# EAGLE design simpleservo2 (EAGLE 4.16)
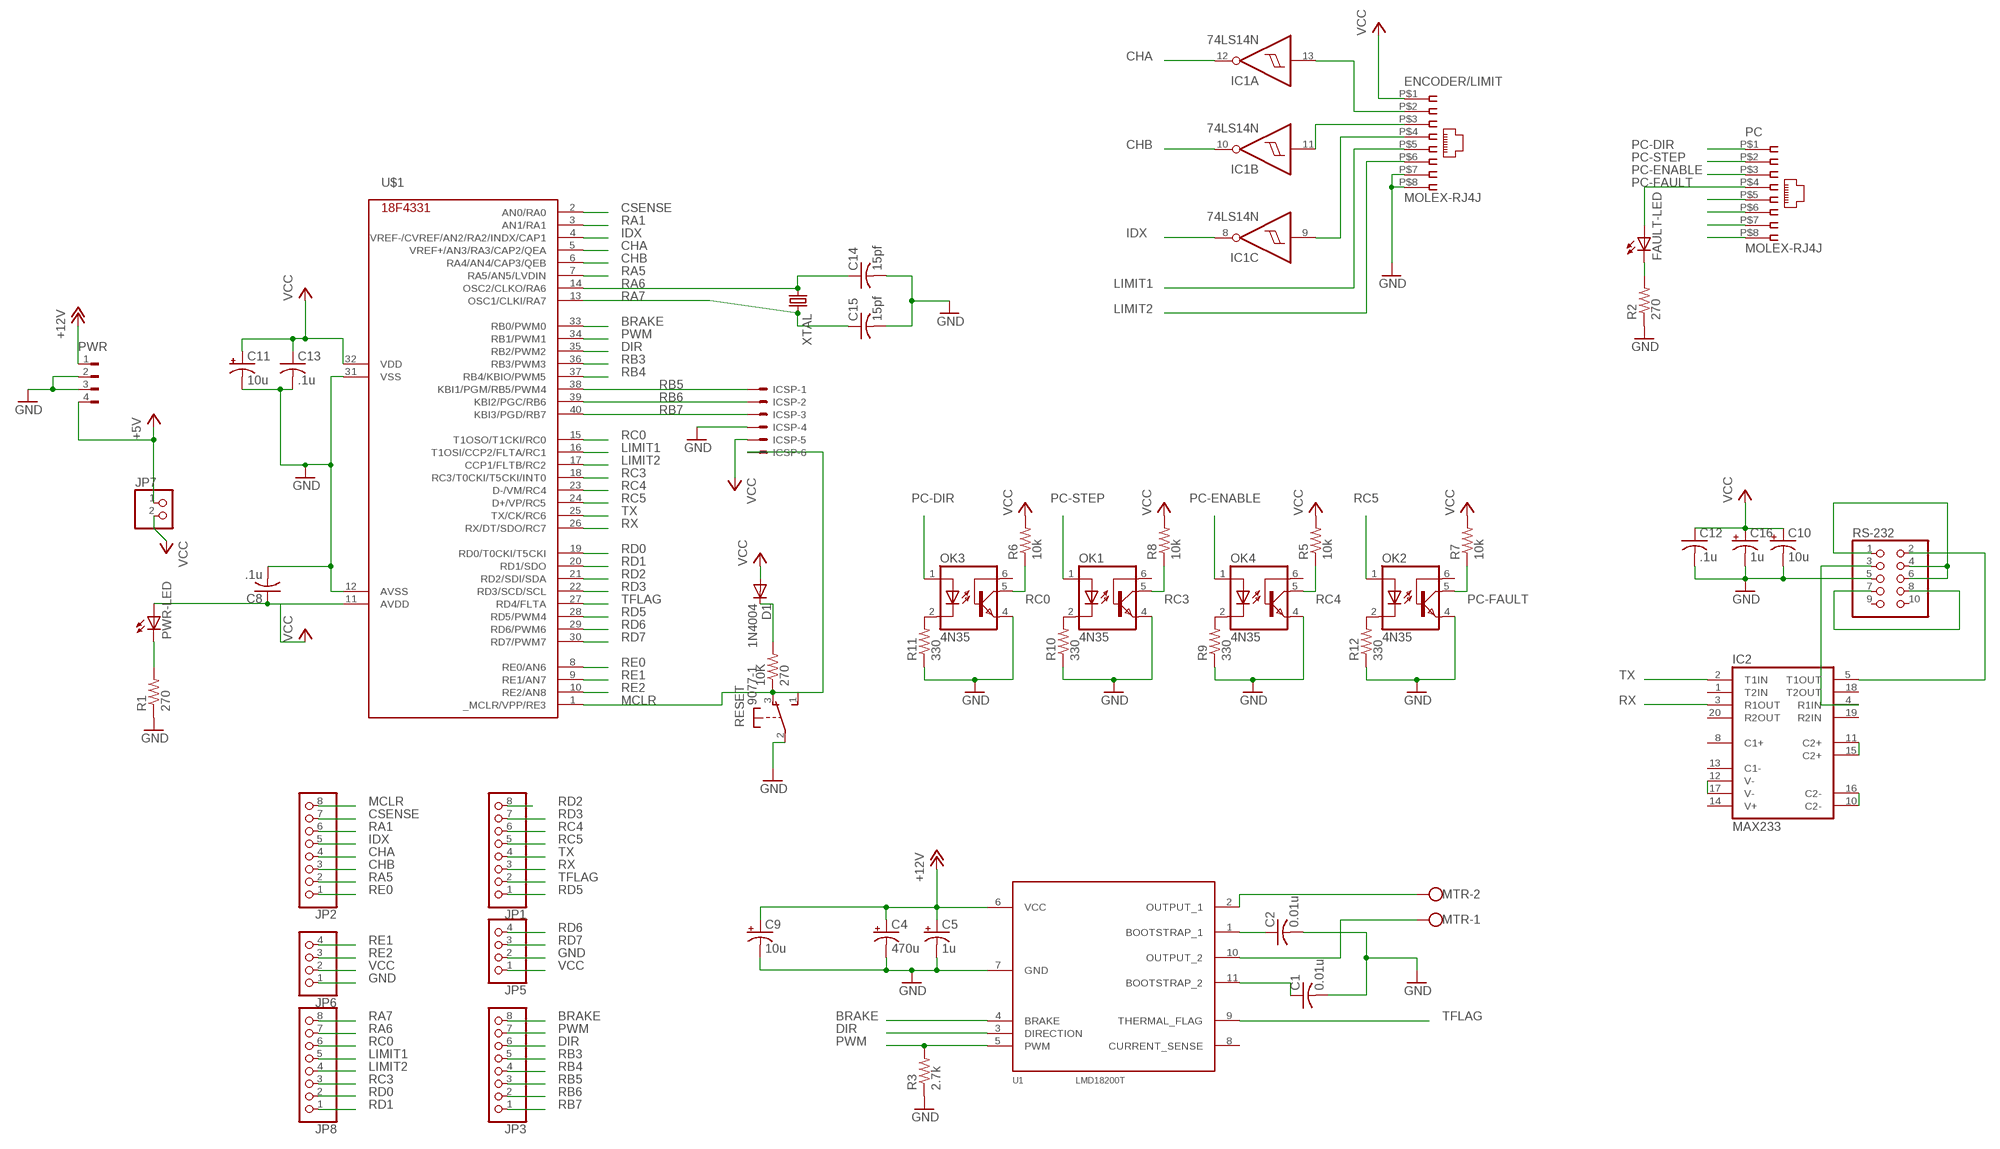
[diagram p0: schematic, sheet 1]

## Parts
10K  270  R-US_0204/2V  [0204V]
C1  0.01u  C-US025-025X050  [C025-025X050]
C2  0.01u  C-US025-025X050  [C025-025X050]
C4  470u  CPOL-USE5-13  [E5-13]
C5  1u  CPOL-USE2.5-5  [E2,5-5]
C8  .1u  C-US025-030X050  [C025-030X050]
C9  10u  CPOL-USE2.5-6  [E2,5-6]
C10  10u  CPOL-USE2.5-6  [E2,5-6]
C11  10u  CPOL-USE2.5-6  [E2,5-6]
C12  .1u  C-US025-030X050  [C025-030X050]
C13  .1u  C-US025-030X050  [C025-030X050]
C14  15pf  C-US025-030X050  [C025-030X050]
C15  15pf  C-US025-030X050  [C025-030X050]
C16  1u  CPOL-USE2.5-6  [E2,5-6]
D1  1N4004  [DO41-10]
ENCODER/LIMIT  MOLEX-RJ4J  [MOLEX-RJ45]
FAULT-LED  LED3MM  [LED3MM]
IC1  74LS14N  [DIL14]
IC2  MAX233  [DIL20]
ICSP  22-23-2061  [22-23-2061]
JP1  PINHD-1X8_2.54  [1X08]
JP2  PINHD-1X8_2.54  [1X08]
JP3  PINHD-1X8_2.54  [1X08]
JP5  PINHD-1X4_2.54  [1X04]
JP6  PINHD-1X4_2.54  [1X04]
JP7  PINHD-1X2_2.54  [1X02]
JP8  PINHD-1X8_2.54  [1X08]
MTR  W237-02P  [W237-132]
OK1  4N35  [DIL06]
OK2  4N35  [DIL06]
OK3  4N35  [DIL06]
OK4  4N35  [DIL06]
PC  MOLEX-RJ4J  [MOLEX-RJ45]
PWR  FLOP-4W827001  [827001]
PWR-LED  LED3MM  [LED3MM]
R1  270  R-US_0204/2V  [0204V]
R2  270  R-US_0204/2V  [0204V]
R3  2.7k  R-US_0204/5  [0204/5]
R5  10k  R-US_0204/2V  [0204V]
R6  10k  R-US_0204/2V  [0204V]
R7  10k  R-US_0204/2V  [0204V]
R8  10k  R-US_0204/2V  [0204V]
R9  330  R-US_0204/2V  [0204V]
R10  330  R-US_0204/2V  [0204V]
R11  330  R-US_0204/2V  [0204V]
R12  330  R-US_0204/2V  [0204V]
RESET  9077-1  [9077-1]
RS-232  PINHD-2X5_2.54  [2X05]
U1  LMD18200T  [TO-220-11]
U$1  PIC18F4331  [DIL40]
XTAL  CRYSTALHC49S  [HC49/S]

## Nets
+5V: JP7.1 PWR.4
+12V: C4.+ C5.+ C9.+ PWR.1 U1.6(VCC)
BRAKE: JP3.8 U1.4(BRAKE) U$1.33(RB0/PWM0)
CHA: IC1.12(A:O) JP2.4 U$1.5(VREF+/AN3/RA3/CAP2/QEA)
CHB: IC1.10(B:O) JP2.3 U$1.6(RA4/AN4/CAP3/QEB)
CSENSE: JP2.7 U$1.2(AN0/RA0)
DIR: JP3.6 U1.3(DIRECTION) U$1.35(RB2/PWM2)
GND: C1.2 C2.2 C4.- C5.- C8.2 C9.- C10.- C11.- C12.2 C13.2 C14.2 C15.2 C16.- ENCODER/LIMIT.P$7 ENCODER/LIMIT.P$8 ICSP.4 JP5.2 JP6.1 OK1.4(EMI) OK2.4(EMI) OK3.4(EMI) OK4.4(EMI) PWR.2 PWR.3 R1.1 R2.1 R3.1 R9.1 R10.1 R11.1 R12.1 RESET.2(P) RS-232.5 U1.7(GND) U$1.12(AVSS) U$1.31(VSS)
IDX: IC1.8(C:O) JP2.5 U$1.4(VREF-/CVREF/AN2/RA2/INDX/CAP1)
LIMIT1: ENCODER/LIMIT.P$5 JP8.5 U$1.16(T1OSI/CCP2/FLTA/RC1)
LIMIT2: ENCODER/LIMIT.P$6 JP8.4 U$1.17(CCP1/FLTB/RC2)
MCLR: 10K.1 ICSP.6 JP2.8 RESET.3(O) U$1.1(_MCLR/VPP/RE3)
N$1: IC2.12(V-) IC2.17(V-)
N$2: C1.1 U1.11(BOOTSTRAP_2)
N$3: MTR.2 U1.2(OUTPUT_1)
N$4: MTR.1 U1.10(OUTPUT_2)
N$5: C2.1 U1.1(BOOTSTRAP_1)
N$6: OK3.2(C) R11.2
N$7: IC2.11(C2+) IC2.15(C2+)
N$8: OK1.2(C) R10.2
N$9: OK4.2(C) R9.2
N$10: OK2.2(C) R12.2
N$11: 10K.2 D1.C
N$12: IC2.10(C2-) IC2.16(C2-)
N$14: PWR-LED.K(C) R1.2
N$16: RS-232.1 RS-232.4 RS-232.6
N$17: ENCODER/LIMIT.P$2 IC1.13(A:I)
N$18: ENCODER/LIMIT.P$3 IC1.11(B:I)
N$19: ENCODER/LIMIT.P$4 IC1.9(C:I)
N$21: FAULT-LED.K(C) R2.2
N$22: RS-232.7 RS-232.8
N$23: IC2.5(T1OUT) RS-232.2
N$24: IC2.4(R1IN) RS-232.3
N$28: PC.P$5
N$29: PC.P$6
N$30: PC.P$7
N$31: PC.P$8
PC-DIR: OK3.1(A) PC.P$1
PC-ENABLE: OK4.1(A) PC.P$3
PC-FAULT: FAULT-LED.A OK2.5(COL) PC.P$4 R7.1
PC-STEP: OK1.1(A) PC.P$2
PWM: JP3.7 R3.2 U1.5(PWM) U$1.34(RB1/PWM1)
RA1: JP2.6 U$1.3(AN1/RA1)
RA5: JP2.2 U$1.7(RA5/AN5/LVDIN)
RA6: C14.1 JP8.7 U$1.14(OSC2/CLKO/RA6) XTAL.1
RA7: C15.1 JP8.8 U$1.13(OSC1/CLKI/RA7) XTAL.2
RB3: JP3.5 U$1.36(RB3/PWM3)
RB4: JP3.4 U$1.37(RB4/KBIO/PWM5)
RB5: ICSP.1 JP3.3 U$1.38(KBI1/PGM/RB5/PWM4)
RB6: ICSP.2 JP3.2 U$1.39(KBI2/PGC/RB6)
RB7: ICSP.3 JP3.1 U$1.40(KBI3/PGD/RB7)
RC0: JP8.6 OK3.5(COL) R6.1 U$1.15(T1OSO/T1CKI/RC0)
RC3: JP8.3 OK1.5(COL) R8.1 U$1.18(RC3/T0CKI/T5CKI/INT0)
RC4: JP1.6 OK4.5(COL) R5.1 U$1.23(D-/VM/RC4)
RC5: JP1.5 OK2.1(A) U$1.24(D+/VP/RC5)
RD0: JP8.2 U$1.19(RD0/T0CKI/T5CKI)
RD1: JP8.1 U$1.20(RD1/SDO)
RD2: JP1.8 U$1.21(RD2/SDI/SDA)
RD3: JP1.7 U$1.22(RD3/SCD/SCL)
RD5: JP1.1 U$1.28(RD5/PWM4)
RD6: JP5.4 U$1.29(RD6/PWM6)
RD7: JP5.3 U$1.30(RD7/PWM7)
RE0: JP2.1 U$1.8(RE0/AN6)
RE1: JP6.4 U$1.9(RE1/AN7)
RE2: JP6.3 U$1.10(RE2/AN8)
RX: IC2.3(R1OUT) JP1.3 U$1.26(RX/DT/SDO/RC7)
TFLAG: JP1.2 U1.9(THERMAL_FLAG) U$1.27(RD4/FLTA)
TX: IC2.2(T1IN) JP1.4 U$1.25(TX/CK/RC6)
VCC: C8.1 C10.+ C11.+ C12.1 C13.1 C16.+ D1.A ENCODER/LIMIT.P$1 ICSP.5 JP5.1 JP6.2 JP7.2 PWR-LED.A R5.2 R6.2 R7.2 R8.2 U$1.11(AVDD) U$1.32(VDD)
Unconnected: IC1.1(D:I) IC1.2(D:O) IC1.3(E:I) IC1.4(E:O) IC1.5(F:I) IC1.6(F:O) IC2.1(T2IN) IC2.8(C1+) IC2.13(C1-) IC2.14(V+) IC2.18(T2OUT) IC2.19(R2IN) IC2.20(R2OUT) OK1.6(BAS) OK2.6(BAS) OK3.6(BAS) OK4.6(BAS) RESET.1(S) RS-232.9 RS-232.10 U1.8(CURRENT_SENSE)

## Power pins joined to a net without a drawn wire
GND: IC1.7(P:GND) IC2.6(GND) IC2.9(GND)
VCC: IC1.14(P:VCC) IC2.7(VCC)

## Library data of the parts
10K R1-R3 R5-R12 = rcl:R-US_: RESISTOR, American symbol
C1 C2 C8 C12-C15 = rcl:C-US: CAPACITOR, American symbol
C4 C5 C9-C11 C16 = rcl:CPOL-US: POLARIZED CAPACITOR, American symbol
D1 = diode:1N4004: DIODE general purpose rectifier, 1 A
ENCODER/LIMIT PC = con-rj45:MOLEX-RJ4J
FAULT-LED PWR-LED = led:LED: LED OSRAM: - CHIPLED LG R971, LG N971, LY N971, LG Q971, LY Q971, LO R971, LY R971 LH N974, LH R974 LS Q976, LO Q976, LY Q976 LO Q996 - Hyper CHIPLED LW Q18S LB Q993, LB Q99A, LB R99A - SideLED LS A670, LO A670, LY A670, LG A670, LP A670 LB A673, LV A673, LT A673, LW A673 LH A674 LY A675 LS A676, LA A676, LO A676, LY A676, LW A676 LS A679, LY A679, LG A679 - Hyper Micro SIDELED® LS Y876, LA Y876, LO Y876, LY Y876 LT Y87S - SmartLED LW L88C, LW L88S LB L89C, LB L89S, LG L890 LS L89K, LO L89K, LY L89K LS L896, LA L896, LO L896, LY L896 - TOPLED LS T670, LO T670, LY T670, LG T670, LP T670 LSG T670, LSP T670, LSY T670, LOP T670, LYG T670 LG T671, LOG T671, LSG T671 LB T673, LV T673, LT T673, LW T673 LH T674 LS T676, LA T676, LO T676, LY T676, LB T676, LH T676, LSB T676, LW T676 LB T67C, LV T67C, LT T67C, LS T67K, LO T67K, LY T67K, LW E67C LS E67B, LA E67B, LO E67B, LY E67B, LB E67C, LV E67C, LT E67C LW T67C LS T679, LY T679, LG T679 LS T770, LO T770, LY T770, LG T770, LP T770 LB T773, LV T773, LT T773, LW T773 LH T774 LS E675, LA E675, LY E675, LS T675 LS T776, LA T776, LO T776, LY T776, LB T776 LHGB T686 LT T68C, LB T68C - Hyper Mini TOPLED® LB M676 - Mini TOPLED Santana® LG M470 LS M47K, LO M47K, LY M47K Source: http://www.osram.convergy.de - LUMILED® LXK2-PW12-R00, LXK2-PW12-S00, LXK2-PW14-U00, LXK2-PW14-V00 LXK2-PM12-R00, LXK2-PM12-S00, LXK2-PM14-U00 LXK2-PE12-Q00, LXK2-PE12-R00, LXK2-PE12-S00, LXK2-PE14-T00, LXK2-PE14-U00 LXK2-PB12-K00, LXK2-PB12-L00, LXK2-PB12-M00, LXK2-PB14-N00, LXK2-PB14-P00, LXK2-PB14-Q00 LXK2-PR12-L00, LXK2-PR12-M00, LXK2-PR14-Q00, LXK2-PR14-R00 LXK2-PD12-Q00, LXK2-PD12-R00, LXK2-PD12-S00 LXK2-PH12-R00, LXK2-PH12-S00 LXK2-PL12-P00, LXK2-PL12-Q00, LXK2-PL12-R00 Source: www.luxeon.com
IC1 = 74xx-us:74*14: Hex schmitt trigger INVERTER
IC2 = maxim:MAX233: RS232 TRANSEIVER
ICSP = con-molex:22-23-2061: .100" (2.54mm) Center Header - 6 Pin
JP1-JP3 JP8 = pinhead-1:PINHD-1X8: PIN HEADER
JP5 JP6 = pinhead-1:PINHD-1X4: PIN HEADER
JP7 = pinhead-1:PINHD-1X2: PIN HEADER
MTR = con-wago-508:W237-02P: WAGO SREW CLAMP
OK1-OK4 = optocoupler:4N35: MOTOROLA OPTO COUPLER
PWR = con-amp:FLOP-4W: MATE N-LOCK Floppy / HDD conector Distributor: Bürklin 71F972
RESET = switch-misc:9077-1: MARQUARDT SWITCH
RS-232 = pinhead-1:PINHD-2X5: PIN HEADER
U1 = lmd1820x:LMD18200: National Semiconductor LMD18200 3A, 55V H-Bridge
U$1 = microchip-pic18fxx5x:PIC18F4331
XTAL = crystal:CRYSTAL: CRYSTAL

## Board
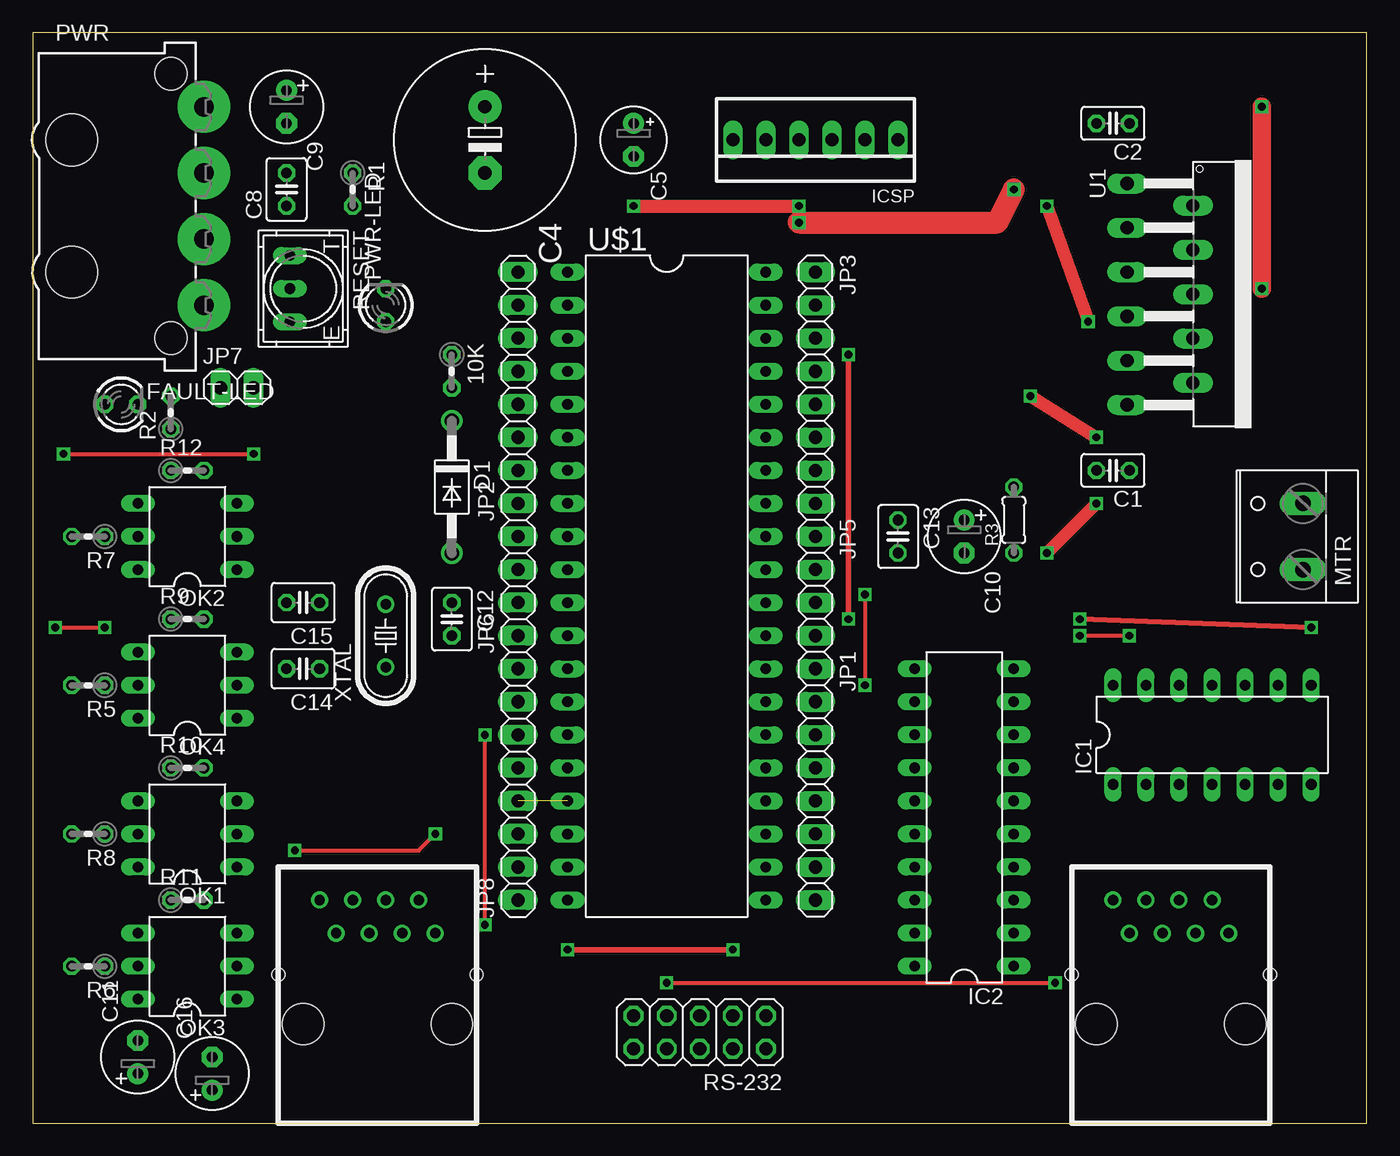
[diagram p1: board, top side]
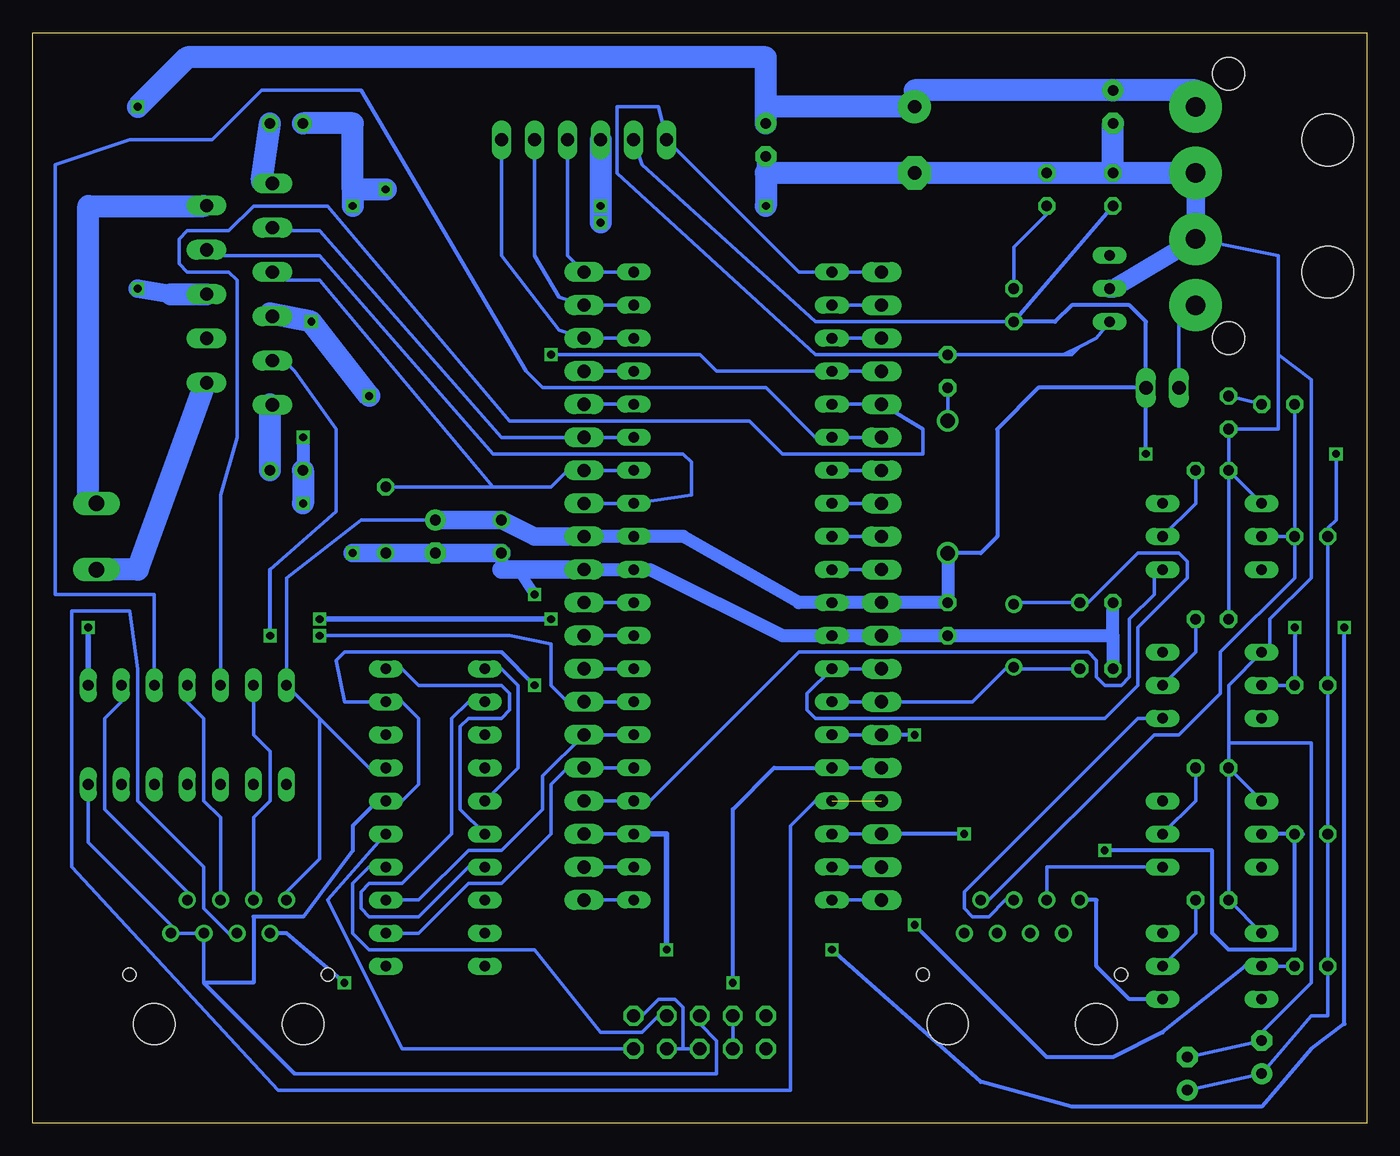
[diagram p2: board, bottom side, seen from below]

Size 102.54 x 83.81 mm. Coordinates in mm from the lower left corner, seen from the top.
Outline: 0,0 102.54,0 102.54,83.81 0,83.81 0,0
Copper layers (1*16): Top 0.035mm / dielectric 1.5mm / Bottom 0.035mm
Design rules "default": minimum track width 10mil, minimum drill 24mil, track to track 8mil, track to pad 8mil, pad to pad 8mil, via to via 8mil, smd to smd 8mil, copper to edge 40mil, drill to drill 8mil, minimum pad ring 10mil, minimum via ring 8mil, stop-mask expansion 4mil, vias tented up to drill 0mil, thermal gap 10mil

### Footprints (pad centres in the part's own frame; a part is rotated, then mirrored left to right if it is on the bottom)
0204V = drill 0.813 octagon: 1 -1.27,0; 2 1.27,0
C025-025X050 = drill 0.813 octagon: 1 -1.27,0; 2 1.27,0
E5-13 = drill 1.016 pad 2.54 round: + -2.54,0 | drill 1.016 pad 2.54 octagon: - 2.54,0
E2,5-5 = drill 0.813 pad 1.6 round: + -1.27,0 | drill 0.813 pad 1.6 octagon: - 1.27,0
C025-030X050 = drill 0.813 octagon: 1 -1.27,0; 2 1.27,0
E2,5-6 = drill 0.813 pad 1.6 round: + -1.27,0 | drill 0.813 pad 1.6 octagon: - 1.27,0
DO41-10 = drill 1.118 round: A 5.08,0; C -5.08,0
MOLEX-RJ45 = drill 0.8 round: P$1 -3.81,2.54; P$2 -1.27,2.54; P$3 1.27,2.54; P$4 3.81,2.54; P$5 -2.54,0; P$6 0,0; P$7 2.54,0; P$8 5.08,0 | hole 3.2: -5.08,-6.985; 6.35,-6.985 | hole 1: -6.985,-3.175; 8.255,-3.175
LED3MM = drill 0.813 octagon: A -1.27,0; K 1.27,0
DIL14 = drill 0.813 long: 1 -7.62,-3.81; 2 -5.08,-3.81; 3 -2.54,-3.81; 4 0,-3.81; 5 2.54,-3.81; 6 5.08,-3.81; 7 7.62,-3.81; 8 7.62,3.81; 9 5.08,3.81; 10 2.54,3.81; 11 0,3.81; 12 -2.54,3.81; 13 -5.08,3.81; 14 -7.62,3.81
DIL20 = drill 0.813 long: 1 -11.43,-3.81; 2 -8.89,-3.81; 3 -6.35,-3.81; 4 -3.81,-3.81; 5 -1.27,-3.81; 6 1.27,-3.81; 7 3.81,-3.81; 8 6.35,-3.81; 9 8.89,-3.81; 10 11.43,-3.81; 11 11.43,3.81; 12 8.89,3.81; 13 6.35,3.81; 14 3.81,3.81; 15 1.27,3.81; 16 -1.27,3.81; 17 -3.81,3.81; 18 -6.35,3.81; 19 -8.89,3.81; 20 -11.43,3.81
22-23-2061 = drill 1 long: 1 -6.35,0; 2 -3.81,0; 3 -1.27,0; 4 1.27,0; 5 3.81,0; 6 6.35,0
1X08 = drill 1.016 long: 1 -8.89,0; 2 -6.35,0; 3 -3.81,0; 4 -1.27,0; 5 1.27,0; 6 3.81,0; 7 6.35,0; 8 8.89,0
1X04 = drill 1.016 long: 1 -3.81,0; 2 -1.27,0; 3 1.27,0; 4 3.81,0
1X02 = drill 1.016 long: 1 -1.27,0; 2 1.27,0
W237-132 = drill 1.194 long: 1 -2.54,-0.635; 2 2.54,-0.635
DIL06 = drill 0.813 long: 1 -2.54,-3.81; 2 0,-3.81; 3 2.54,-3.81; 4 2.54,3.81; 5 0,3.81; 6 -2.54,3.81
827001 = drill 1.5 pad 4 round: 1 -7.62,0; 2 -2.54,0; 3 2.54,0; 4 7.62,0 | hole 4: 5.08,-10.16; -5.08,-10.16 | hole 2.5: 10.16,-2.54; -10.16,-2.54
0204/5 = drill 0.813 octagon: 1 -2.54,0; 2 2.54,0
9077-1 = drill 0.813 long: 1 -2.54,-1.016; 2 0,-1.016; 3 2.54,-1.016
2X05 = drill 1.016 octagon: 1 -5.08,-1.27; 2 -5.08,1.27; 3 -2.54,-1.27; 4 -2.54,1.27; 5 0,-1.27; 6 0,1.27; 7 2.54,-1.27; 8 2.54,1.27; 9 5.08,-1.27; 10 5.08,1.27
TO-220-11 = drill 1.016 long: 1 -8.084,-2.718; 2 -6.382,2.337; 3 -4.68,-2.718; 4 -2.978,2.337; 5 -1.276,-2.718; 6 0.425,2.337; 7 2.127,-2.718; 8 3.829,2.337; 9 5.531,-2.718; 10 7.233,2.337; 11 8.934,-2.718
DIL40 = drill 0.813 long: 1 -24.13,-7.62; 2 -21.59,-7.62; 3 -19.05,-7.62; 4 -16.51,-7.62; 5 -13.97,-7.62; 6 -11.43,-7.62; 7 -8.89,-7.62; 8 -6.35,-7.62; 9 -3.81,-7.62; 10 -1.27,-7.62; 11 1.27,-7.62; 12 3.81,-7.62; 13 6.35,-7.62; 14 8.89,-7.62; 15 11.43,-7.62; 16 13.97,-7.62; 17 16.51,-7.62; 18 19.05,-7.62; 19 21.59,-7.62; 20 24.13,-7.62; 21 24.13,7.62; 22 21.59,7.62; 23 19.05,7.62; 24 16.51,7.62; 25 13.97,7.62; 26 11.43,7.62; 27 8.89,7.62; 28 6.35,7.62; 29 3.81,7.62; 30 1.27,7.62; 31 -1.27,7.62; 32 -3.81,7.62; 33 -6.35,7.62; 34 -8.89,7.62; 35 -11.43,7.62; 36 -13.97,7.62; 37 -16.51,7.62; 38 -19.05,7.62; 39 -21.59,7.62; 40 -24.13,7.62
HC49/S = drill 0.813 round: 1 -2.413,0; 2 2.413,0

### Placement (x,y rotation side)
10K  32.22,57.78 270 top
C1  83.02,50.16 180 top
C2  83.02,76.83 180 top
C4  34.76,75.56 270 top
C5  46.19,75.56 270 top
C8  19.52,71.75 90 top
C9  19.52,78.1 270 top
C10  71.59,45.08 270 top
C11  8.09,5.08 90 top
C12  32.22,38.73 270 top
C13  66.51,45.08 270 top
C14  20.79,34.92 180 top
C15  20.79,40 180 top
C16  13.81,3.8 90 top
D1  32.22,48.89 270 top
ENCODER/LIMIT  86.83,14.6 0 top
FAULT-LED  6.82,55.24 0 top
IC1  90.64,29.84 0 top
IC2  71.59,23.49 90 top
ICSP  60.16,75.56 180 top
JP1  60.16,26.03 270 top
JP2  37.3,56.51 90 top
JP3  60.16,56.51 270 top
JP5  60.16,41.27 270 top
JP6  37.3,41.27 90 top
JP7  15.71,56.51 0 top
JP8  37.3,26.03 90 top
MTR  96.99,45.08 90 top
OK1  11.9,22.22 90 top
OK2  11.9,45.08 90 top
OK3  11.9,12.06 90 top
OK4  11.9,33.65 90 top
PC  25.87,14.6 0 top
PWR  13.17,70.48 270 top
PWR-LED  27.14,62.86 90 top
R1  24.6,71.75 270 top
R2  10.63,54.61 90 top
R3  75.4,46.35 90 top
R5  4.28,33.65 180 top
R6  4.28,12.06 180 top
R7  4.28,45.08 180 top
R8  4.28,22.22 180 top
R9  11.9,38.73 0 top
R10  11.9,27.3 0 top
R11  11.9,17.14 0 top
R12  11.9,50.16 0 top
RESET  20.79,64.13 270 top
RS-232  51.27,6.98 180 top
U1  86.83,64.13 270 top
U$1  48.73,41.27 270 top
XTAL  27.14,37.46 90 top

### Tracks (layer width: path | path; a pad name or v marks a point on that pad's centre or on a via)
+5V
  Bottom 0.254: JP7.1 14.44,61.59 PWR.4
+12V  (via drill 0.6)
  Top 1.422: v94.45,78.1 v94.45,64.13
  Bottom 1.016: PWR.1 13.17,79.37 | 34.76,79.37 C4.+ | 46.19,78.1 C5.+
  Bottom 1.422: v94.45,64.13 91.91,63.71
  Bottom 1.676: 13.17,79.37 C9.+ 34.76,79.37 | C4.+ 46.19,78.1 | C5.+ 46.19,81.91 90.64,81.91 v94.45,78.1 | 91.91,63.71 U1.6
BRAKE
  Bottom 0.254: JP3.8 U$1.33 51.91,48.26 51.91,50.8 52.54,51.43 67.14,51.43 80.48,66.67 88.1,66.67 U1.4
CHA
  Bottom 0.254: U$1.5 JP2.4 34.12,53.34 34.12,51.43 44.92,51.43 47.46,53.97 65.88,53.97 79.84,70.48 85.56,70.48 87.47,68.57 90.64,68.57 91.28,67.94 91.28,66.03 90.64,65.4 87.47,65.4 86.83,64.77 86.83,52.7 88.1,48.26 IC1.12
CHB
  Bottom 0.254: IC1.10 93.18,40.64 100.8,40.64 100.8,73.66 95.08,75.56 88.73,75.56 84.92,79.37 77.3,79.37 64.61,57.78 63.34,56.51 46.19,56.51 42.38,52.7 U$1.6 JP2.3
CSENSE
  Bottom 0.254: JP2.7 U$1.2
DIR
  Bottom 0.254: U$1.35 JP3.6 66.51,52.7 80.48,68.57 83.02,68.57 U1.3
GND  (via drill 0.6)
  Top 0.305: v63.97,40.64 v63.97,33.65
  Top 1.016: v77.94,70.48 v81.11,61.59 | v76.67,55.88 v81.75,52.7 | v81.75,47.62 v77.94,43.81 | v46.19,70.48 v58.89,70.48
  Top 1.676: v58.89,69.21 74.13,69.21 v75.4,71.75
  Bottom 0.254: IC1.7 98.26,21.58 91.91,15.24 ENCODER/LIMIT.P$8 ENCODER/LIMIT.P$7 89.37,10.79 | 82.39,3.8 50,3.8 50,6.34 51.27,7.62 RS-232.5 | C16.- C11.- 8.09,6.98 4.28,10.79 4.28,29.2 10.63,29.2 | OK3.4 R11.1 R10.1 | R10.1 OK1.4 | 10.63,29.2 10.63,33.65 OK4.4 7.46,36.83 7.46,38.73 4.28,41.91 4.28,57.15 6.82,59.05 | 10.63,29.2 R10.1 | R12.1 OK2.4 | R12.1 R9.1 | R12.1 R2.1 6.82,53.34 6.82,59.05 | IC2.6 74.13,24.76 72.86,26.03 72.86,31.11 74.13,32.38 IC2.9 78.58,32.38 79.21,35.55 78.58,36.19 66.51,36.19 | 6.82,59.05 6.82,66.67 PWR.3
  Bottom 0.305: v63.97,33.65 66.51,36.19 | IC2.6 76.03,24.76 77.94,22.86 77.94,20.95 81.75,15.87 85.56,15.87 85.56,10.79 89.37,10.79 82.39,3.8
  Bottom 0.813: 65.24,42.54 v63.97,40.64
  Bottom 1.016: JP5.2 U$1.31 55.08,42.54 44.92,37.46 U$1.12 JP6.1 C12.2 19.52,37.46 | C13.2 66.51,42.54 | v81.75,52.7 C1.2 | 84.29,62.23 U1.7 | 19.52,37.46 C14.2 | 19.52,37.46 C15.2
  Bottom 1.422: PWR.2 PWR.3 19.52,64.13 RESET.2 | 46.19,73.02 C5.- | 66.51,42.54 65.24,42.54 JP5.2 | C13.2 C10.- R3.1 v77.94,43.81 | v58.89,70.48 ICSP.4
  Bottom 1.676: PWR.2 C8.2 | C8.2 R1.1 C4.- 46.19,73.02 v46.19,70.48 | C8.2 C9.- | 77.94,71.75 v77.94,70.48 | 77.94,71.75 77.94,76.83 C2.2 | 84.29,62.23 v81.11,61.59 v76.67,55.88 | C1.2 v81.75,47.62 | ICSP.4 v58.89,69.21 | v75.4,71.75 77.94,71.75
IDX  (via drill 0.6)
  Top 0.406: v62.7,59.05 v62.7,38.73 | v80.48,38.73 v98.26,38.1
  Bottom 0.254: JP2.5 U$1.4 50,57.78 51.27,59.05 v62.7,59.05
  Bottom 0.406: v98.26,38.1 IC1.8 | v62.7,38.73 v80.48,38.73
LIMIT1  (via drill 0.6)
  Top 0.305: v48.73,10.79 v78.58,10.79
  Bottom 0.254: U$1.16 JP8.5
  Bottom 0.305: ENCODER/LIMIT.P$5 83.02,14.6 v78.58,10.79 | U$1.16 45.55,27.3 48.73,24.12 v48.73,10.79
LIMIT2  (1 unrouted)
  Bottom 0.254: ENCODER/LIMIT.P$6 87.47,14.6 89.37,16.5 89.37,19.68 94.45,24.76 94.45,34.92 95.08,39.37 99.53,39.37 99.53,19.68 83.66,2.54 44.28,2.54 44.28,22.86 42.38,24.76 U$1.17
MCLR
  Bottom 0.254: 22.06,59.69 20.79,60.32 RESET.3 | 22.06,59.69 23.33,59.05 | 22.06,59.69 22.7,59.05 23.33,59.05 | 23.33,59.05 10K.1 42.38,59.05 57.62,73.02 57.62,78.1 54.45,78.1 ICSP.6 43.65,65.4 U$1.1 JP2.8
N$1
  Bottom 0.254: IC2.17 69.05,19.68 72.86,15.87 76.67,15.87 77.3,16.5 77.3,17.77 76.67,18.41 74.13,18.41 70.32,22.22 70.32,31.11 69.05,32.38 IC2.12
N$2
  Bottom 1.016: 84.29,55.24 U1.11
  Bottom 1.676: C1.1 84.29,55.24
N$3
  Bottom 1.016: MTR.2 98.26,47.62 | 89.37,70.48 U1.2
  Bottom 1.676: 98.26,47.62 98.26,70.48 89.37,70.48
N$4
  Bottom 1.016: 89.37,56.51 U1.10
  Bottom 1.676: MTR.1 94.45,42.54 89.37,56.51
N$5
  Bottom 1.016: U1.1 84.92,72.38
  Bottom 1.676: 84.92,72.38 C2.1
N$6
  Bottom 0.254: OK3.2 13.17,14.6 R11.2
N$7
  Bottom 0.254: IC2.15 65.24,27.3 65.24,33.65 66.51,34.92 IC2.11
N$8
  Bottom 0.254: R10.2 13.17,24.76 OK1.2
N$9
  Bottom 0.254: OK4.2 13.17,36.19 R9.2
N$10
  Bottom 0.254: R12.2 13.17,47.62 OK2.2
N$11
  Bottom 0.254: D1.C 10K.2
N$12
  Bottom 0.254: IC2.16 69.69,24.12 69.69,30.47 69.05,31.11 66.51,31.11 65.88,31.74 65.88,33.02 66.51,33.65 72.86,33.65 74.13,34.92 IC2.10
N$14
  Bottom 0.254: PWR-LED.K 27.14,67.3 24.6,69.84 R1.2
N$16
  Bottom 0.254: RS-232.6 52.54,5.71 | 52.54,5.71 RS-232.4 | 52.54,5.71 52.54,8.89 53.17,9.52 54.45,9.52 55.71,8.25 RS-232.1
N$17
  Bottom 0.254: ENCODER/LIMIT.P$2 85.56,23.49 84.29,24.76 84.29,28.57 85.56,29.84 IC1.13
N$18
  Bottom 0.254: ENCODER/LIMIT.P$3 88.1,23.49 89.37,24.76 89.37,31.11 90.64,32.38 IC1.11
N$19
  Bottom 0.254: ENCODER/LIMIT.P$4 90.64,17.77 96.99,24.12 96.99,31.11 95.72,32.38 IC1.9
N$21
  Bottom 0.254: FAULT-LED.K R2.2
N$22
  Bottom 0.254: RS-232.8 RS-232.7
N$23
  Bottom 0.254: IC2.5 79.84,17.14 74.13,5.71 RS-232.2
N$24
  Bottom 0.254: IC2.4 76.67,19.68 77.94,18.41 77.94,14.6 76.67,13.33 63.97,13.33 58.89,6.98 55.71,6.98 54.45,8.25 RS-232.3
PC-DIR
  Bottom 0.305: OK3.1 18.25,9.52 20.79,12.06 20.79,17.14 PC.P$1
PC-ENABLE
  Bottom 0.254: PC.P$3 27.77,17.14 29.04,15.87 30.31,15.87 30.95,16.5 30.95,17.77 17.61,31.11 OK4.1
PC-FAULT
  Bottom 0.254: PC.P$4 29.04,17.14 16.34,29.84 14.44,29.84 11.27,33.02 11.27,36.19 5.55,41.91 R7.1 | R7.1 FAULT-LED.A | R7.1 OK2.5
PC-STEP
  Bottom 0.254: PC.P$2 24.6,19.68 OK1.1
PWM
  Bottom 0.254: 67.14,48.89 62.7,48.89 61.43,50.16 JP3.7 U$1.34 | 67.14,48.89 R3.2 | 67.14,48.89 80.48,64.77 83.02,64.77 U1.5
RA1
  Bottom 0.254: JP2.6 U$1.3
RA5
  Bottom 0.254: JP2.2 U$1.7
RA6
  Bottom 0.254: U$1.14 JP8.7 30.31,32.38 27.77,34.92 XTAL.1 26.5,34.92 C14.1
RA7
  Bottom 0.254: JP8.8 U$1.13 43.02,33.02 43.02,31.74 42.38,31.11 20.15,31.11 17.61,33.65 17.61,38.1 13.81,41.91 13.81,43.18 14.44,43.81 17.61,43.81 21.42,40 C15.1 26.5,40 XTAL.2
RB3
  Bottom 0.254: U$1.36 JP3.5
RB4
  Bottom 0.254: U$1.37 JP3.4
RB5
  Bottom 0.254: U$1.38 JP3.3 62.06,60.96 66.51,66.67 ICSP.1
RB6
  Bottom 0.254: U$1.39 JP3.2 62.06,63.5 63.97,66.67 ICSP.2
RB7
  Bottom 0.254: U$1.40 JP3.1 61.43,66.67 ICSP.3
RC0  (via drill 0.6)
  Top 0.305: v34.76,15.24 v34.76,29.84
  Bottom 0.254: R6.1 OK3.5 | JP8.6 U$1.15
  Bottom 0.305: OK3.5 9.36,12.06 15.71,6.98 19.52,5.08 24.6,5.08 v34.76,15.24 | v34.76,29.84 JP8.6
RC3  (via drill 0.6)
  Top 0.305: v20.15,20.95 29.68,20.95 v30.95,22.22
  Bottom 0.254: R8.1 OK1.5 | JP8.3 U$1.18
  Bottom 0.305: v30.95,22.22 JP8.3 | R8.1 OK1.5 | R8.1 4.92,22.22 | R8.1 5.55,13.33 10.63,13.33 11.9,14.6 11.9,20.95 v20.15,20.95
RC4  (via drill 0.6)
  Top 0.305: v1.74,38.1 v5.55,38.1
  Top 0.406: v41.11,13.33 v53.81,13.33
  Bottom 0.254: R5.1 OK4.5 | U$1.23 JP1.6
  Bottom 0.305: v41.11,13.33 29.68,3.17 22.7,1.27 8.09,1.27 4.28,5.71 1.74,7.62 v1.74,38.1 | v5.55,38.1 R5.1
  Bottom 0.406: U$1.23 53.81,22.22 v53.81,13.33
RC5
  Bottom 0.254: JP1.5 U$1.24 55.08,24.76 43.65,36.19 21.42,36.19 20.79,35.55 20.79,34.29 20.15,33.65 18.88,33.65 18.25,34.29 18.25,38.73 16.34,40.64 16.34,41.91 OK2.1
RD0
  Bottom 0.254: JP8.2 U$1.19
RD1
  Bottom 0.254: JP8.1 U$1.20
RD2
  Bottom 0.254: U$1.21 JP1.8
RD3
  Bottom 0.254: U$1.22 JP1.7
RD5
  Bottom 0.254: U$1.28 JP1.1
RD6
  Bottom 0.254: U$1.29 JP5.4
RD7
  Bottom 0.254: U$1.30 JP5.3
RE0
  Bottom 0.254: JP2.1 U$1.8
RE1
  Bottom 0.254: JP6.4 U$1.9
RE2
  Bottom 0.254: JP6.3 U$1.10
RX
  Bottom 0.254: IC2.3 72.86,17.14 69.05,20.95 66.51,20.95 63.34,24.12 63.34,26.66 JP1.3 U$1.26
TFLAG  (via drill 0.6)
  Top 0.305: v80.48,37.46 v84.29,37.46
  Bottom 0.254: U$1.27 JP1.2 61.43,32.38 62.7,33.65 62.7,36.83 65.88,37.46 v80.48,37.46 | 84.29,42.54 79.21,46.98 79.21,53.34 82.39,57.78 83.02,58.41 U1.9
  Bottom 0.305: v84.29,37.46 84.29,42.54
TX
  Bottom 0.254: IC2.2 72.86,14.6 69.05,18.41 66.51,18.41 62.7,22.22 62.7,26.03 61.43,27.3 JP1.4 U$1.25
VCC  (via drill 0.6)
  Top 0.305: v2.38,51.43 v16.98,51.43
  Bottom 0.254: C16.+ C11.+ 4.28,8.25 3.01,8.25 R6.2 R8.2 R5.2 R7.2 3.01,45.72 2.38,46.35 v2.38,51.43 | 80.48,31.11 80.48,20.31 83.02,17.77 ENCODER/LIMIT.P$1 | 80.48,31.11 IC1.14 83.02,41.91 77.3,46.35 C10.+ | 80.48,31.11 76.67,27.3 IC2.7 | ICSP.5 55.71,73.66 42.38,61.59 PWR-LED.A
  Bottom 0.305: C8.1 PWR-LED.A 23.96,61.59 22.7,62.86 18.25,62.86 16.98,61.59 JP7.2 | D1.A 29.68,43.81 28.41,45.08 28.41,53.34 25.23,56.51 JP7.2 | v16.98,51.43 JP7.2
  Bottom 1.016: D1.A C12.1 JP6.2 U$1.11 43.65,40 52.54,45.08 U$1.32 JP5.1
  Bottom 1.422: JP5.1 63.97,45.08 C13.1 C10.+